# EAGLE design photonLED (EAGLE 7.6.0)
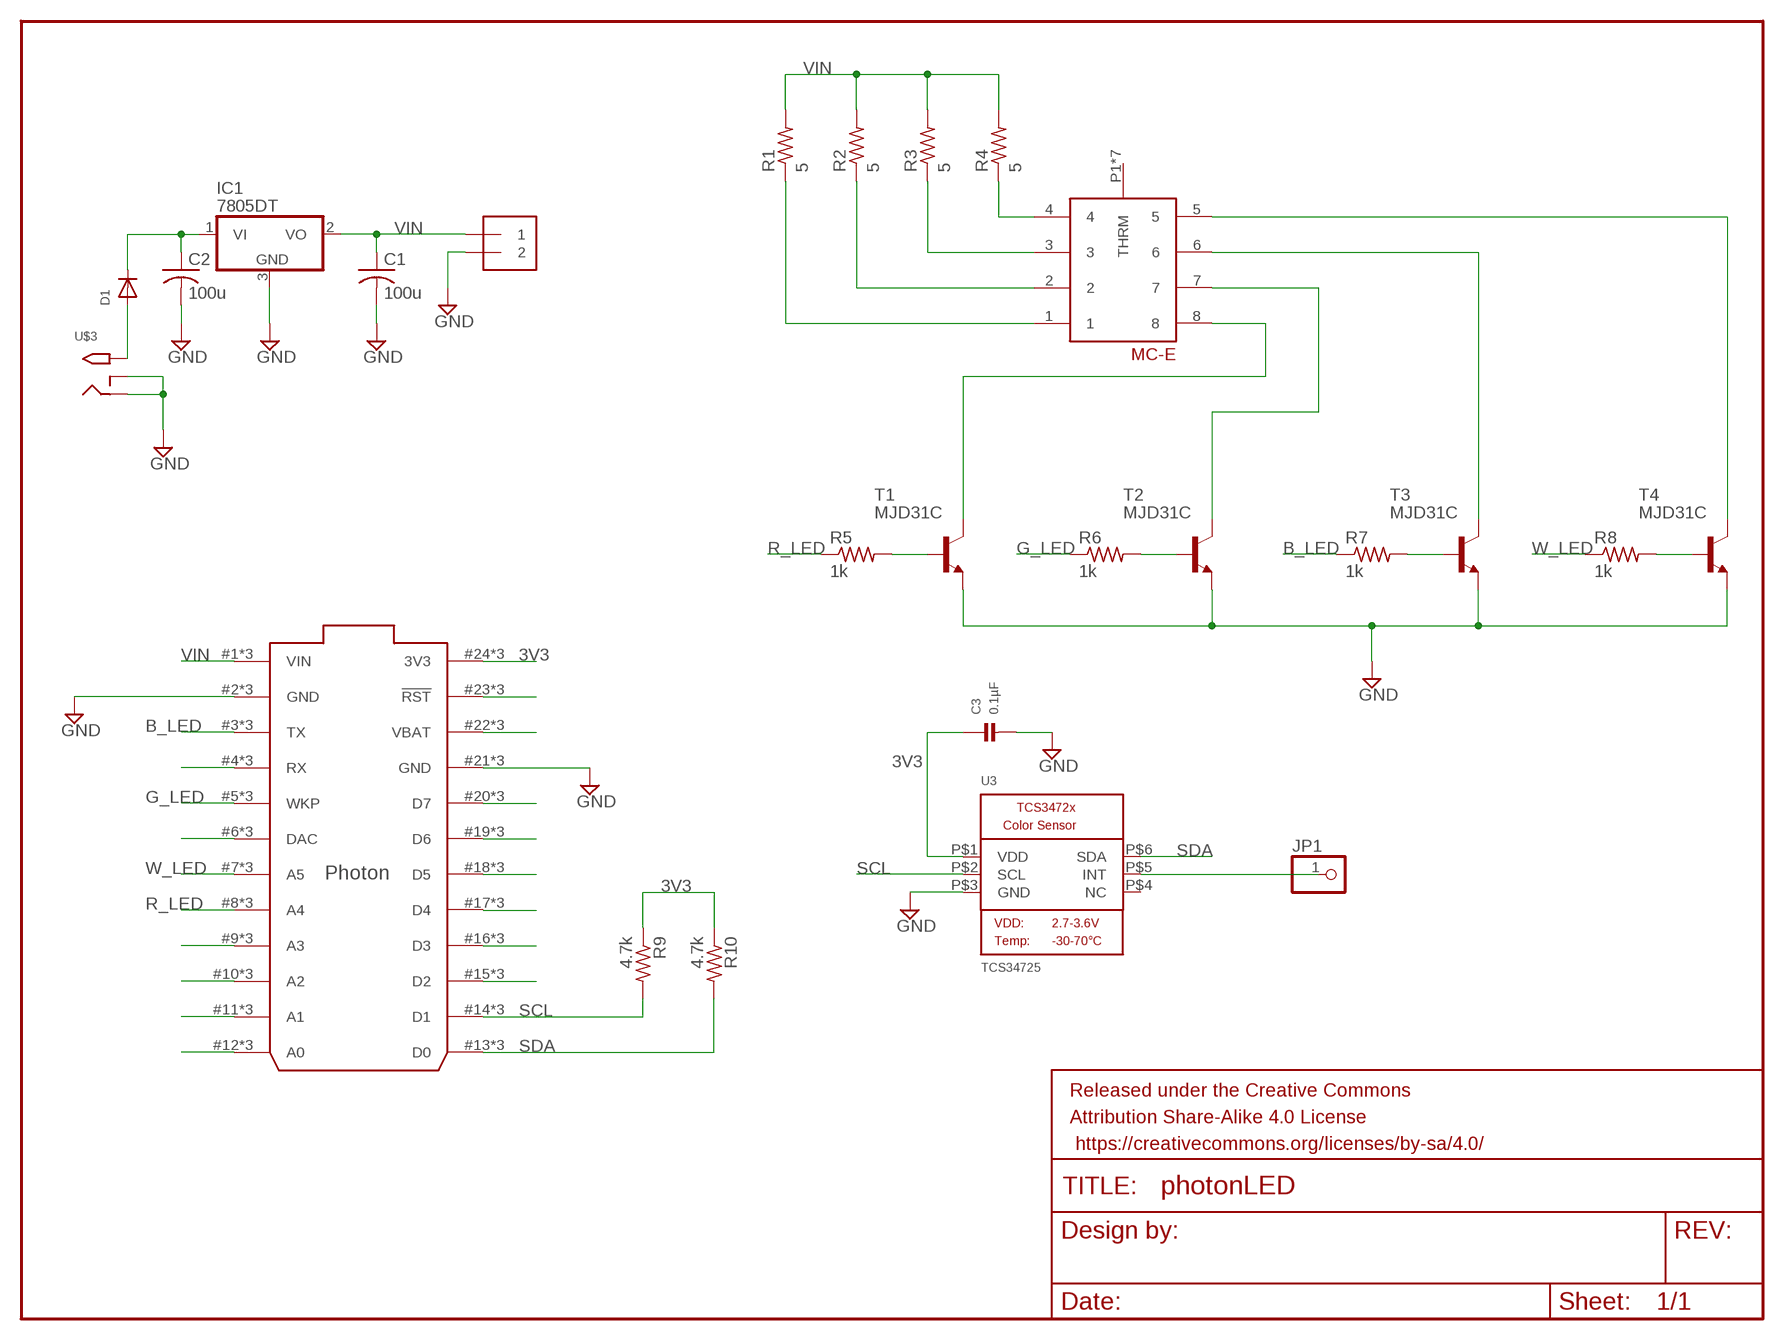
[diagram p0: schematic, sheet 1]

## Parts
C1  100u  C-USC0805  [C0805]
C2  100u  C-USC0805  [C0805]
C3  0.1µF  CAP_CERAMIC_0805  [_0805]
D1  DIODESOD-123  [SOD-123]
FRAME1  FRAME-LETTER  [CREATIVE_COMMONS]
IC1  7805DT  [TO252]
J1  3.5MM Screw Term  1X2-3.5MM  [1X2-3.5MM]
JP1  PINHD-1X1  [1X01]
R1  5  R-US_R2512  [R2512]
R2  5  R-US_R2512  [R2512]
R3  5  R-US_R2512  [R2512]
R4  5  R-US_R2512  [R2512]
R5  1k  R-US_R0805  [R0805]
R6  1k  R-US_R0805  [R0805]
R7  1k  R-US_R0805  [R0805]
R8  1k  R-US_R0805  [R0805]
R9  4.7k  R-US_R0805  [R0805]
R10  4.7k  R-US_R0805  [R0805]
T1  MJD31C  [DPAK]
T2  MJD31C  [DPAK]
T3  MJD31C  [DPAK]
T4  MJD31C  [DPAK]
U3  TCS34725  LIGHT_TCS3472  [TCS3472_FN6]
U$1  PHOTON_WITH_STACKABLE_HEADERS  [PHOTON_STACKABLE]
U$2  MC-E  [MC-E]
U$3  2.1MMJACKSMT  [DCJACK_2MM_SMT]

## Nets
3V3: C3.1 R9.1 R10.1 U3.P$1(VDD) U$1.24(3V3) U$1.#24(3V3) U$1.@24(3V3)
B_LED: R7.1 U$1.3(TX) U$1.#3(TX) U$1.@3(TX)
G_LED: R6.1 U$1.5(WKP) U$1.#5(WKP) U$1.@5(WKP)
GND: C1.2 C2.2 C3.2 IC1.3(GND) J1.2 T1.3(E) T2.3(E) T3.3(E) T4.3(E) U3.P$3(GND) U$1.2(GND) U$1.21(GND) U$1.#2(GND) U$1.#21(GND) U$1.@2(GND) U$1.@21(GND) U$3.GND(RING) U$3.GNDBREAK(RING_SW)
N$1: R4.1 U$2.4
N$2: R3.1 U$2.3
N$3: R2.1 U$2.2
N$4: R1.1 U$2.1
N$5: T1.4(C) U$2.8
N$6: R6.2 T2.1(B)
N$7: T2.4(C) U$2.7
N$8: T3.4(C) U$2.6
N$9: D1.A U$3.PWR2(TIP)
N$10: C2.1 D1.C IC1.1(VI)
N$11: JP1.1 U3.P$5(INT)
N$12: U$1.10(A2) U$1.#10(A2) U$1.@10(A2)
N$14: U$1.6(DAC) U$1.#6(DAC) U$1.@6(DAC)
N$15: U$1.4(RX) U$1.#4(RX) U$1.@4(RX)
N$17: U$1.9(A3) U$1.#9(A3) U$1.@9(A3)
N$18: T4.4(C) U$2.5
N$19: U$1.11(A1) U$1.#11(A1) U$1.@11(A1)
N$20: U$1.12(A0) U$1.#12(A0) U$1.@12(A0)
N$22: U$1.23(!RST) U$1.#23(!RST) U$1.@23(!RST)
N$23: U$1.22(VBAT) U$1.#22(VBAT) U$1.@22(VBAT)
N$24: U$1.20(D7) U$1.#20(D7) U$1.@20(D7)
N$25: U$1.19(D6) U$1.#19(D6) U$1.@19(D6)
N$26: U$1.18(D5) U$1.#18(D5) U$1.@18(D5)
N$27: U$1.17(D4) U$1.#17(D4) U$1.@17(D4)
N$28: U$1.16(D3) U$1.#16(D3) U$1.@16(D3)
N$29: U$1.15(D2) U$1.#15(D2) U$1.@15(D2)
N$32: R5.2 T1.1(B)
N$34: R7.2 T3.1(B)
N$35: R8.2 T4.1(B)
R_LED: R5.1 U$1.8(A4) U$1.#8(A4) U$1.@8(A4)
SCL: R9.2 U3.P$2(SCL) U$1.14(D1) U$1.#14(D1) U$1.@14(D1)
SDA: R10.2 U3.P$6(SDA) U$1.13(D0) U$1.#13(D0) U$1.@13(D0)
VIN: C1.1 IC1.2(VO) J1.1 R1.2 R2.2 R3.2 R4.2 U$1.1(VIN) U$1.#1(VIN) U$1.@1(VIN)
W_LED: R8.1 U$1.7(A5) U$1.#7(A5) U$1.@7(A5)
Unconnected: U3.P$4(NC) U$2.P1(THRM) U$2.P2(THRM) U$2.P3(THRM) U$2.P4(THRM) U$2.P5(THRM) U$2.THRM U$2.THRML(THRM)

## Library data of the parts
C1 C2 = adafruit:C-US: CAPACITOR, American symbol
C3 = microbuilder:CAP_CERAMIC: Ceramic Capacitors 0402 - 0402 Surface Mount Capacitors 16pF 50V 5% [Digikey: 445-4899-2-ND] 18pF 50V 5% [Digikey: 490-1281-2-ND] 22pF 50V 5% [Digikey: 490-1283-2-ND] 68pF 50V 5% [Digikey: 490-1289-2-ND] 0.1uF 10V 10% [Digikey: 490-1318-2-ND] 1.0uF 6.3V 10% [Digikey: 490-1320-2-ND] 0603 - 0603 Surface Mount Capacitors 16 pF 50V 5% [Digikey: 445-5051-2-ND] 22 pF 50V [Digikey: PCC220ACVTR-ND] 33 pF 50V 5% [Digikey: 490-1415-1-ND] 56pF 50V 5% [Digikey: 490-1421-1-ND] 220pF 50V 5% [Digikey: 445-1285-1-ND] 680 pF 50V 2200 pF 50V 5% C0G [Digikey: 445-1297-1-ND] 5600 pF 100V 5% X7R [Digikey: 478-3711-1-ND] 0.1 µF 25V 10% [Digikey: PCC2277TR-ND] 0.22 µF 16V 10% X7R [Digikey: 445-1318-1-ND] 1.0 µF 25V 10% [Digikey: 445-5146-2-ND] 0603 - RF Specific 3pF 250V +/-0.1pF RF [Digikey: 712-1347-1-ND] 18 pF 250V 5% [Digikey: 478-3505-1-ND or 712-1322-1-ND] 56 pF 250V 5% C0G RF [Digikey: 490-4867-1-ND] 68 pF 250V RF [Digikey: 490-4868-1-ND] 0805 - 0805 Surface Mount Capacitors 220 pF 250V 2% RF Ceramic Capacitor [Digikey: 712-1398-1-ND] 1000 pF 50V 2% NP0 Ceramic Capacitor [Digikey: 478-3760-1-ND] 0.1 µF 25V 10% Ceramic Capacitor [Digikey: PCC1828TR-ND] 1.0 µF 16V 10% Ceramic Capacitor[Digikey: 490-1691-2-ND] 10.0 µF 10V 10% Ceramic Capacitor[Digikey: 709-1228-1-ND] 10.0 uF 16V 10% Ceramic Capacitor [Digikey: 478-5165-2-ND] 47 uF 6.3V 20% Ceramic Capacitor [Digikey: 587-1779-1-ND or 399-5506-1-ND] 1206 - 1206 Surface Mount Capacitors 47uF 10V 20% Ceramic Capacitor [Digikey: 490-5528-1-ND or 399-5508-1-ND or 445-6010-1-ND] 100uF 6.3V -20%, +80% Y5V Ceramic Capacitor (Digikey: 490-4512-1-ND, Mouser: 81-GRM31CF50J107ZE1L)
D1 = adafruit:DIODE: Diode SMADIODE - SMA Surface Mount Package 20V 1A Schottky Diode Digikey: 641-1014-6-ND DO-1N4148 - Through Hole Small Current Diode SOD-123 20V 1 A (.5mV Vf) Schottky Diode - Digikey: MBRX120TPMSCT-ND SOD-323 10V 570mA (.38mV Vf, 3ns) Schottky Diode - Digikey: ZLLS410CT-ND SOD-523 30V 30mA Schottky Diode (RB751S-40TE61) - Digikey: RB751S-40TE61CT-ND SOT23-R/W - SOT23 Package (R = Solder Paste/Reflow Ovens, W = Hand-Soldering) BAT54Film 40V 300mA - Digikey: 497-7162-1-ND
FRAME1 = SparkFun-Aesthetics:FRAME-LETTER: Schematic Frame Standard 8.5x11 US Letter frame
IC1 = adafruit:78*: Positive VOLTAGE REGULATOR Added bigger pads to the TO-92 package
J1 = adafruit:1X2: 3.5mm Terminal block http://www.ladyada.net/library/pcb/eaglelibrary.html
JP1 = adafruit:PINHD-1X1: Pin header 1x1 for 0.1" spacing With round pins
R1-R10 = adafruit:R-US_: RESISTOR, American symbol
T1-T4 = transistor:MJD31*: Complementary Power Transistors
U3 = microbuilder:LIGHT_TCS3472: TCS3472 RGB + Clear Color Sensor VDD: 2.7-3.6V Temp: -30 - 70°C IR light blocking filter 3,800,000:1 Dynamic Range 2.5µA sleep state Part IDs TCS34725: I2C bus logic = VDD, I2C address: 0x29 TCS34727: I2C bus logic = 1.8V, I2C address: 0x29
U$1 = Spark:PHOTON
U$2 = emily:MC-E
U$3 = adafruit:2.1MMJACK: 2.1mm x 5.5mm THM DC jack with internal switch. Digikey part #PJ-102A, 4UCON part #05537 2.1mm x 5.5mm SMT DC jack with internal switch. Digikey part #PJ-002A-SMT, 4UCON part #03267 By microbuilder.eu & adafruit.com

## Board
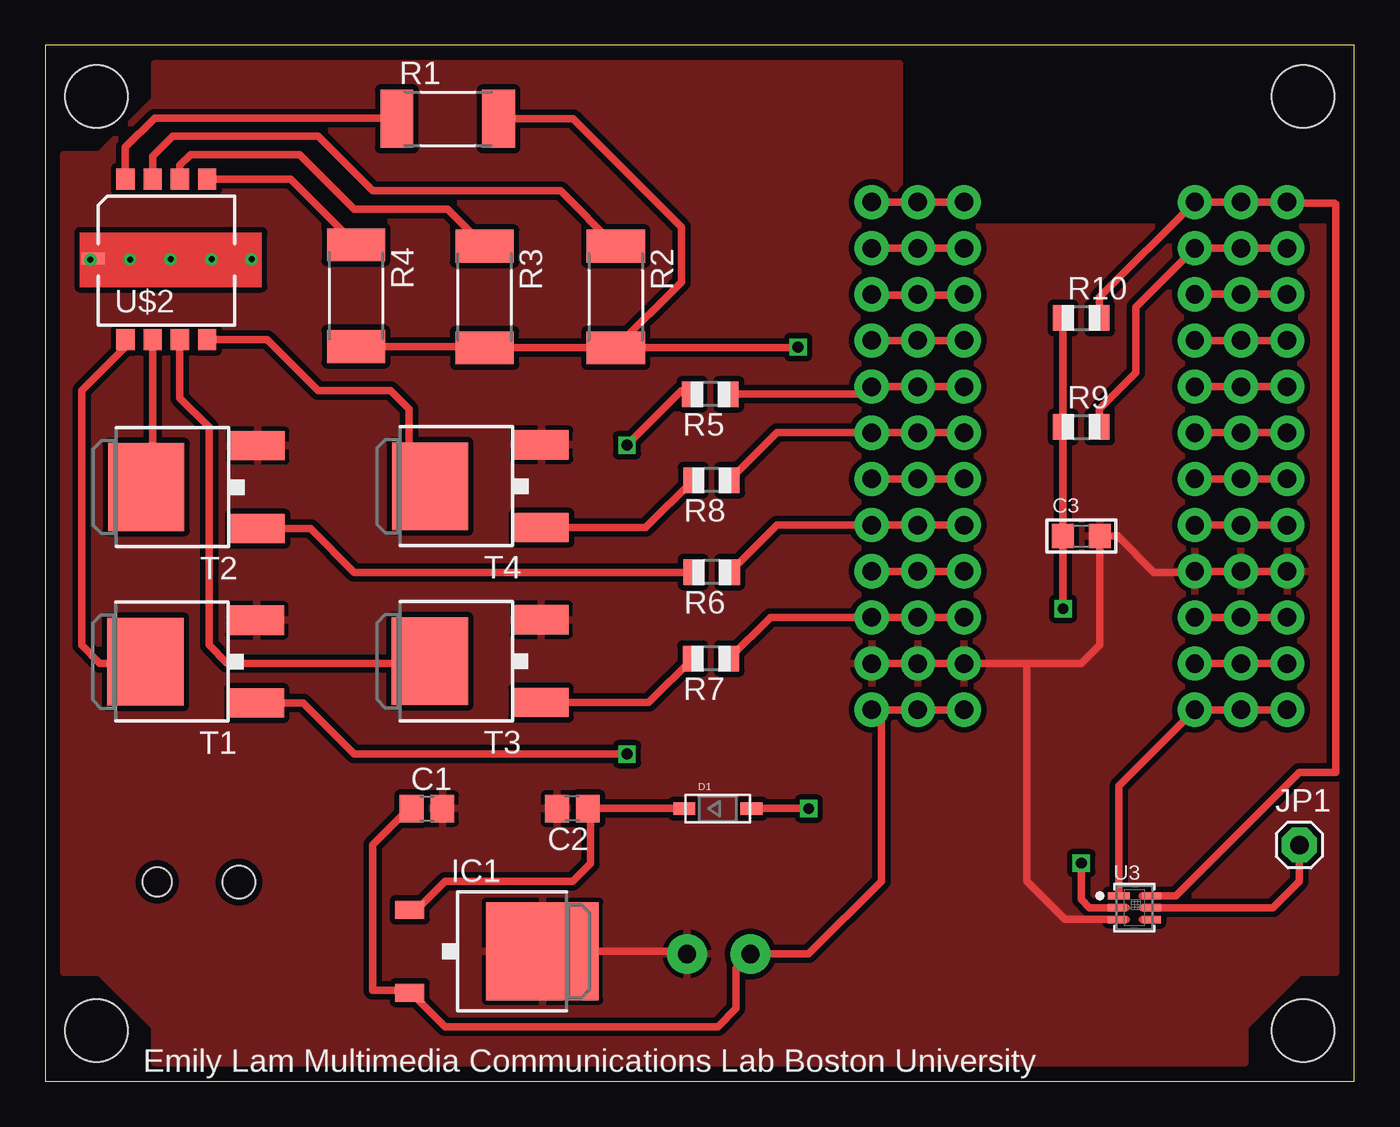
[diagram p1: board, top side]
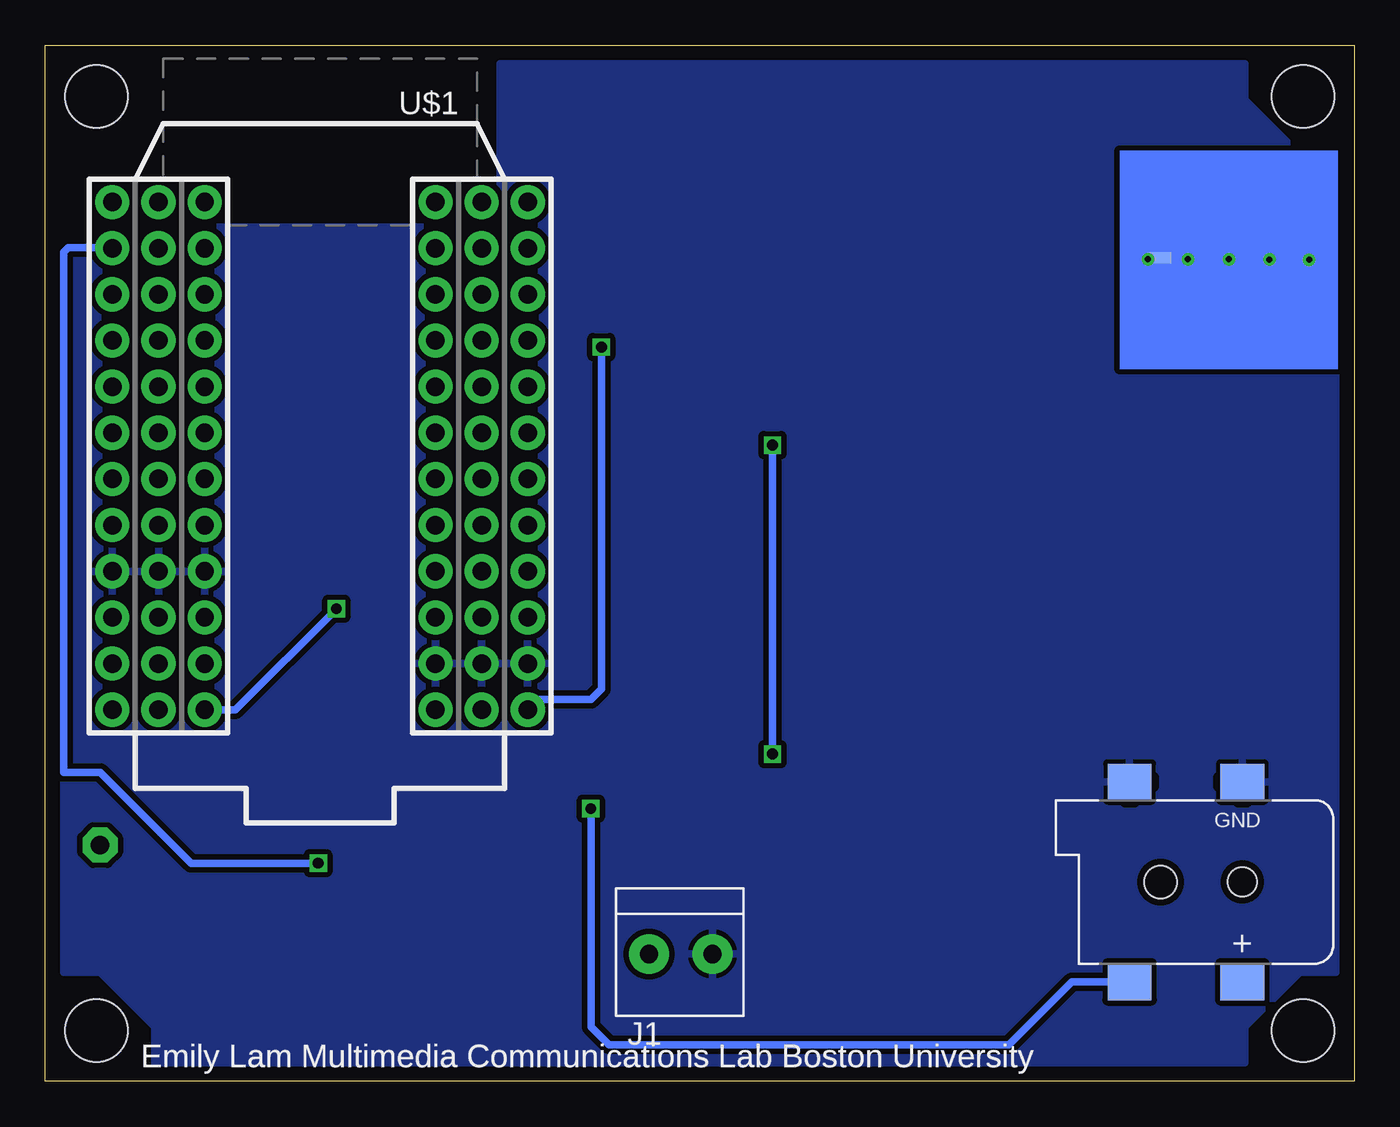
[diagram p2: board, bottom side, seen from below]

Size 72.01 x 57 mm. Coordinates in mm from the lower left corner, seen from the top.
Outline: 0,0 72.01,0 72.01,57 0,57 0,0
Copper layers (1*16): Top 0.0356mm / dielectric 1.5011mm / Bottom 0.0356mm
Design rules "oshpark-2layer": minimum track width 6mil, minimum drill 13mil, track to track 6mil, track to pad 6mil, pad to pad 6mil, via to via 6mil, smd to smd 6mil, copper to edge 15mil, drill to drill 6mil, minimum pad ring 7mil, minimum via ring 7mil, stop-mask expansion 2.5mil, vias tented up to drill 0mil, thermal gap 10mil
Holes 3.45 mm at 69.2,54.2 69.2,2.8 2.8,54.2 2.8,2.8

### Footprints (pad centres in the part's own frame; a part is rotated, then mirrored left to right if it is on the bottom)
C0805 = smd 1.3 x 1.5: 1 -0.85,0; 2 0.85,0
_0805 = smd 1.2 x 1.3: 1 -1.016,0; 2 1.016,0
SOD-123 = smd 1.2 x 0.7: A 1.85,0; C -1.85,0
TO252 = smd 1 x 1.6: 1 -2.28,-4.8; 2 2.28,-4.8 | smd 5.4 x 6.2: 3 0,2.5
1X2-3.5MM = drill 1 pad 2.184: 1 1.8,0; 2 -1.7,0
1X01 = drill 1.016 pad 1.93 octagon: 1 0,0
R2512 = smd 1.8 x 3.2: 1 -2.8,0; 2 2.8,0
R0805 = smd 1.1 x 1.4: 1 -1,0; 2 1,0
DPAK = smd 1.6 x 3: 1 -2.28,-4.04; 3 2.28,-4.04 | smd 4.826 x 4.191: 4 0,2.096
TCS3472_FN6 = smd 1.2 x 0.4: P$1 -0.85,0.65 | smd 1 x 0.4: P$2 -0.95,0; P$3 -0.95,-0.65; P$4 0.95,-0.65; P$5 0.95,0; P$6 0.95,0.65
PHOTON_STACKABLE = drill 1.016 pad 1.88: 1 1.27,32.258; 2 1.27,29.718; 3 1.27,27.178; 4 1.27,24.638; 5 1.27,22.098; 6 1.27,19.558; 7 1.27,17.018; 8 1.27,14.478; 9 1.27,11.938; 10 1.27,9.398; 11 1.27,6.858; 12 1.27,4.318; 13 19.05,4.318; 14 19.05,6.858; 15 19.05,9.398; 16 19.05,11.938; 17 19.05,14.478; 18 19.05,17.018; 19 19.05,19.558; 20 19.05,22.098; 21 19.05,24.638; 22 19.05,27.178; 23 19.05,29.718; 24 19.05,32.258; #1 3.81,32.258; #2 3.81,29.718; #3 3.81,27.178; #4 3.81,24.638; #5 3.81,22.098; #6 3.81,19.558; #7 3.81,17.018; #8 3.81,14.478; #9 3.81,11.938; #10 3.81,9.398; #11 3.81,6.858; #12 3.81,4.318; #13 21.59,4.318; #14 21.59,6.858; #15 21.59,9.398; #16 21.59,11.938; #17 21.59,14.478; #18 21.59,17.018; #19 21.59,19.558; #20 21.59,22.098; #21 21.59,24.638; #22 21.59,27.178; #23 21.59,29.718; #24 21.59,32.258; @1 -1.27,32.258; @2 -1.27,29.718; @3 -1.27,27.178; @4 -1.27,24.638; @5 -1.27,22.098; @6 -1.27,19.558; @7 -1.27,17.018; @8 -1.27,14.478; @9 -1.27,11.938; @10 -1.27,9.398; @11 -1.27,6.858; @12 -1.27,4.318; @13 16.51,4.318; @14 16.51,6.858; @15 16.51,9.398; @16 16.51,11.938; @17 16.51,14.478; @18 16.51,17.018; @19 16.51,19.558; @20 16.51,22.098; @21 16.51,24.638; @22 16.51,27.178; @23 16.51,29.718; @24 16.51,32.258
MC-E = smd 1 x 1.16: 1 0.5,9.44; 2 2,9.44; 3 3.5,9.44; 4 5,9.44; 5 5,0.6; 6 3.5,0.6; 7 2,0.6; 8 0.5,0.6 | drill 0.33: P1 -1.425,5.005; P2 0.755,5.015; P3 2.985,5.035; P4 5.24,5.035; P5 7.44,5.03 | smd 1.27 x 0.635: THRM -1.27,5.08 | smd 1.27 x 0.635 bottom: THRML 6.8,5.1
DCJACK_2MM_SMT = smd 2.4 x 2: GND 0,-5.5; GNDBREAK 6.2,-5.5; PWR1 0,5.5; PWR2 6.2,5.5 | hole 1.6: 0,0 | hole 1.8: 4.5,0

### Placement (x,y rotation side)
C1  21,15 0 top
C2  29,15 180 top
C3  57,30 0 top
D1  37,15 0 top
FRAME1  7.62,-11.7 0 top  (outside the outline)
IC1  24.85,7.15 270 top
J1  37,7 180 bottom
JP1  69,13 0 top
R1  22.14,52.96 0 top
R2  31.38,43.16 270 top
R3  24.16,43.16 270 top
R4  17.09,43.23 270 top
R5  36.59,37.81 180 top
R6  36.66,28.02 180 top
R7  36.62,23.26 180 top
R8  36.65,33.08 180 top
R9  57,36 0 top
R10  57,42 0 top
T1  7.59,23.09 90 top
T2  7.64,32.69 90 top
T3  23.24,23.11 90 top
T4  23.26,32.74 90 top
U3  59.92,9.55 0 top
U$1  46.74,52.7 180 bottom
U$2  3.9,40.2 0 top
U$3  6.15,10.96 180 bottom

### Tracks (layer width: path | path; a pad name or v marks a point on that pad's centre or on a via)
3V3  (via drill 0.6)
  Top 0.406: U$1.#24 U$1.24 U$1.@24 59.07,16.26 U3.P$1 | v56,26 56,29.98 C3.1 56,30.02 R9.1 R10.1
  Bottom 0.406: U$1.@24 61.56,20.44 v56,26
B_LED
  Top 0.406: U$1.#3 U$1.3 U$1.@3 39.88,25.52 R7.1
G_LED
  Top 0.406: U$1.#5 U$1.5 U$1.@5 40.24,30.6 R6.1
GND
  Top 0.406: U$1.@2 U$1.2 U$1.#2 50.56,23 54,23 | U$1.#21 U$1.21 U$1.@21 63.18,28 61,28 59,30 C3.2 58.02,24.02 57,23 54,23 | J1.2 35.15,7.15 IC1.3 | U3.P$3 56.1,8.9 54,11 54,23
  pour Top (isolate 0.305): 1,6 3,6 6,3 6,1 66,1 66,3 69,6 71,6 71,47 47,47 47,56 6,56 6,54 3,51 1,51
  pour Bottom (isolate 0.305): 1,51 3,51 6,54 6,56 47,56 47,47 71,47 71,6 69,6 66,3 66,1 6,1 6,3 3,6 1,6
N$1
  Top 0.406: U$2.4 13.48,49.64 R4.1
N$2
  Top 0.406: U$2.3 7.4,50.4 8,51 14,51 17,48 22.12,48 R3.1
N$3
  Top 0.406: U$2.2 5.9,50.9 7,52 15,52 18,49 28.34,49 R2.1
N$4
  Top 0.406: U$2.1 4.4,51.4 6,53 19.3,53 R1.1
N$5
  Top 0.406: U$2.8 4.4,40.4 2,38 2,24 3,23 5.41,23 T1.4
N$6
  Top 0.406: T2.1 14.59,30.41 17,28 35.64,28 R6.2
N$7
  Top 0.406: U$2.7 5.9,33.05 T2.4
N$8
  Top 0.406: U$2.6 7.4,37.6 9,36 9,24 10,23 21.04,23 T3.4
N$9  (via drill 0.6)
  Top 0.406: 39,15 D1.A v42,15
  Bottom 0.406: U$3.PWR2 15.54,5.46 19,2 41,2 42,3 v42,15
N$10
  Top 0.406: D1.C C2.1 30,14.85 30,12 29,11 22,11 20.43,9.43 IC1.1
N$11
  Top 0.406: U3.P$5 67.55,9.55 69,11 JP1.1
N$13
  Top 0.406: 45.59,43.26 50.79,43.26
N$14
  Top 0.406: U$1.#6 U$1.6 U$1.@6
N$15
  Top 0.406: U$1.@4 U$1.4 U$1.#4
N$17
  Top 0.406: U$1.@9 U$1.9 U$1.#9
N$18
  Top 0.406: U$2.5 12.2,40.8 15,38 19,38 20,37 20,33.9 T4.4
N$19
  Top 0.406: U$1.@11 U$1.11 U$1.#11
N$20
  Top 0.406: U$1.@12 U$1.12 U$1.#12
N$22
  Top 0.406: U$1.#23 U$1.23 U$1.@23
N$23
  Top 0.406: U$1.#22 U$1.22 U$1.@22
N$24
  Top 0.406: U$1.#20 U$1.20 U$1.@20
N$25
  Top 0.406: U$1.#19 U$1.19 U$1.@19
N$26
  Top 0.406: U$1.#18 U$1.18 U$1.@18
N$27
  Top 0.406: U$1.#17 U$1.17 U$1.@17
N$28
  Top 0.406: U$1.#16 U$1.16 U$1.@16
N$29
  Top 0.406: U$1.#15 U$1.15 U$1.@15
N$32  (via drill 0.6)
  Top 0.406: T1.1 14.19,20.81 17,18 v32,18 | v32,35 35,38 35.4,38 R5.2
  Bottom 0.406: v32,18 v32,35
N$34
  Top 0.406: T3.1 33.19,20.83 R7.2
N$35
  Top 0.406: T4.1 33.03,30.46 R8.2
R_LED
  Top 0.406: R5.1 45.47,37.81 U$1.@8 U$1.8 U$1.#8
SCL  (via drill 0.6)
  Top 0.406: U$1.#14 U$1.14 U$1.@14 60,42.6 60,39 58,37 R9.2 | U3.P$2 57.45,9.55 57,10 v57,12
  Bottom 0.406: v57,12 64,12 69,17 71,17 71,45.63 70.75,45.88 68.36,45.88 U$1.#14
SDA
  Top 0.406: R10.2 58,43.14 U$1.@13 U$1.13 U$1.#13 68.38,48.33 70.93,48.33 71,48.26 71,17 69,17 62.2,10.2 U3.P$6
VIN  (via drill 0.6)
  Top 0.406: R4.2 24.09,40.43 R3.2 R2.2 | R1.2 29.04,52.96 35,47 35,43.98 R2.2 | U$1.#1 U$1.1 U$1.@1 46,19.91 46,11 42,7 J1.1 38,6.2 38,4 37,3 22,3 20.13,4.87 IC1.2 19.92,5 18,5 18,13 20,15 C1.1 | R2.2 41.38,40.36 v41.42,40.4
  Bottom 0.406: v41.42,40.4 41.42,21.58 42,21 44.91,21 U$1.@1
W_LED
  Top 0.406: U$1.#7 U$1.7 U$1.@7 40.25,35.68 R8.1

### Text on the board
tPlace: Emily Lam Multimedia Communications Lab Boston University
bPlace: Emily Lam Multimedia Communications Lab Boston University | Emily Lam Multimedia Communications Lab Boston University